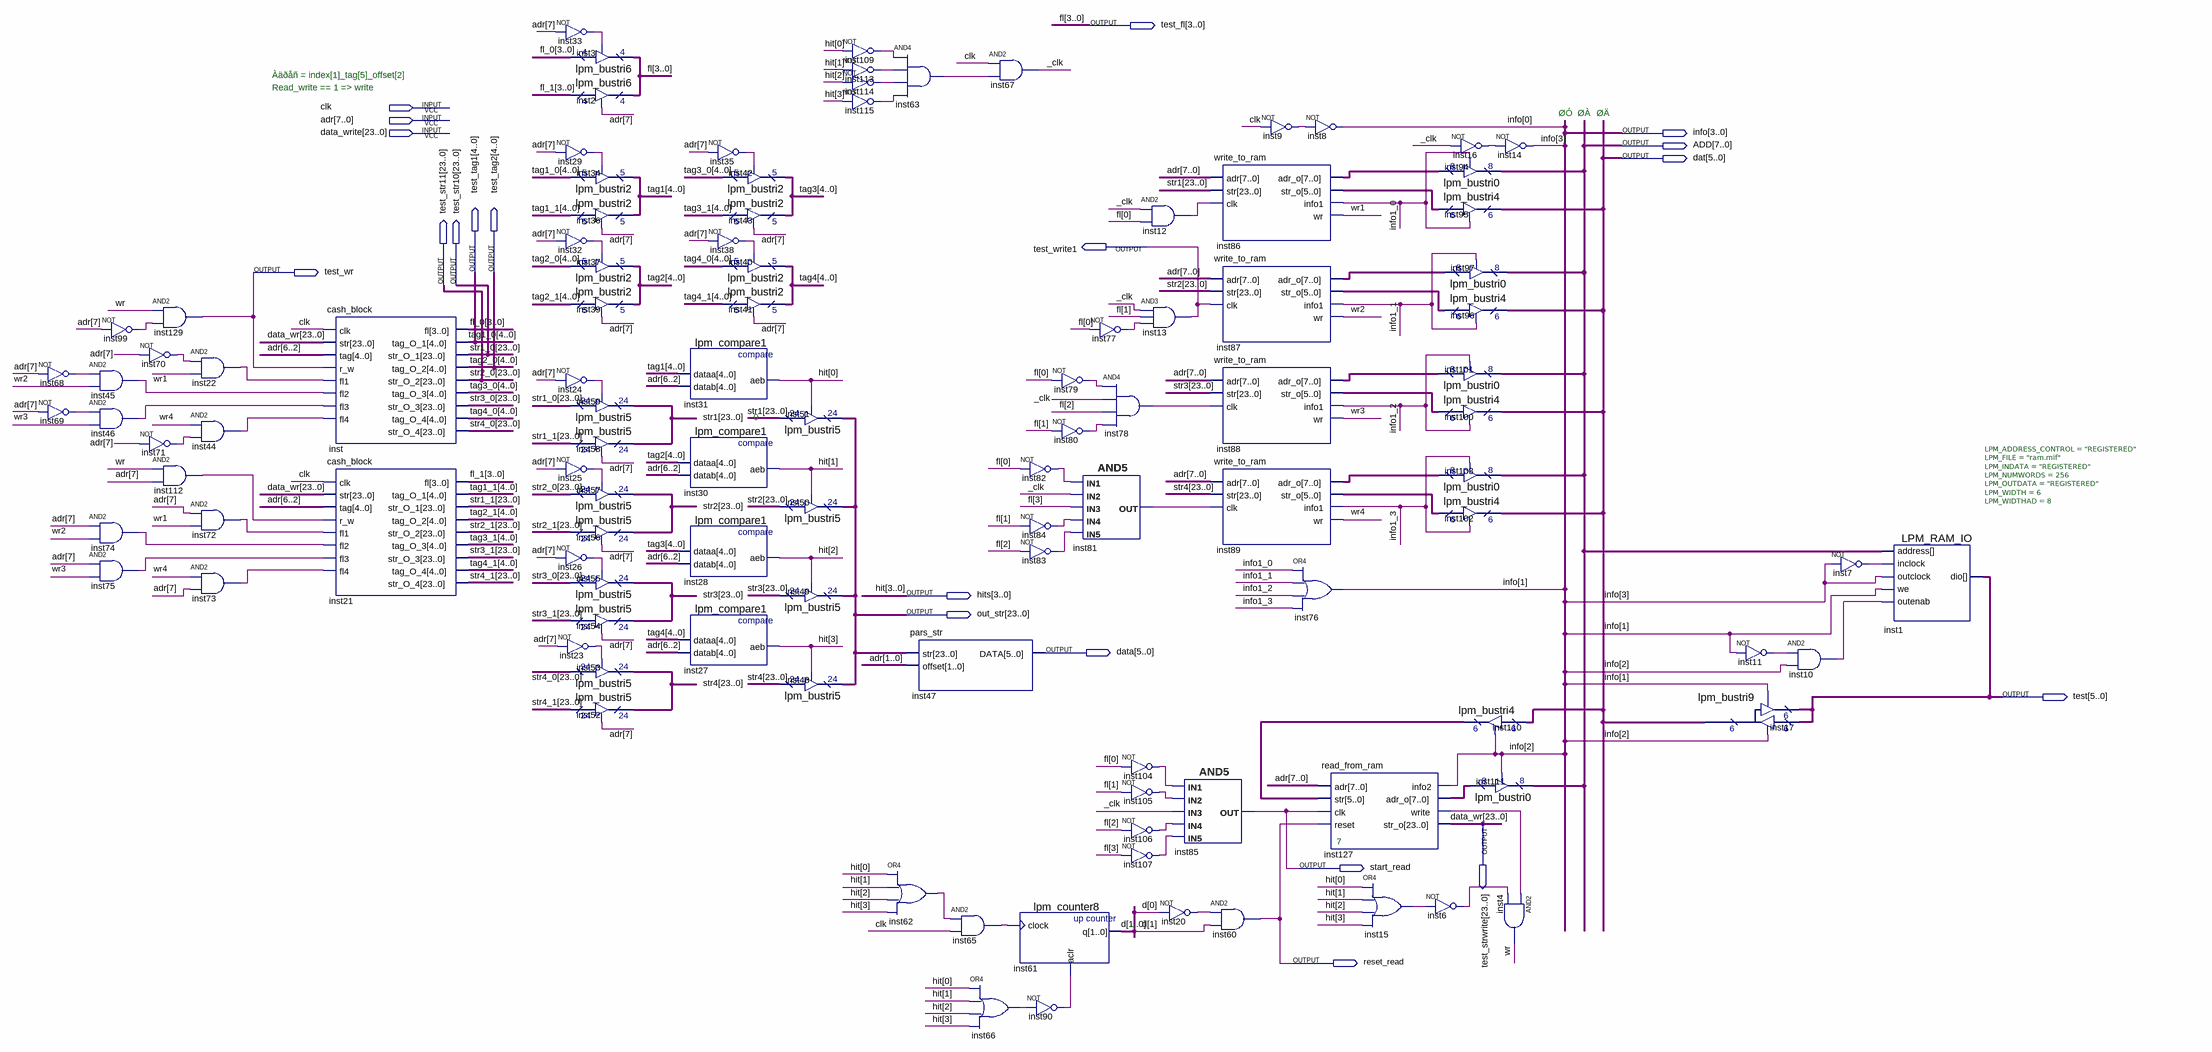
[diagram p0: schematic sheet]
// Quartus schematic lab6.bdf as structural Verilog: 109 symbols, 20 pins
module lab6 (
  input  clk,
  input  [7:0] adr,
  input  [23:0] data_write,
  output [3:0] test_fl,
  output [3:0] info,
  output [7:0] ADD,
  output [5:0] dat,
  output test_write1,
  output test_wr,
  output [4:0] test_tag1,
  output [4:0] test_tag2,
  output [23:0] test_str11,
  output [23:0] test_str10,
  output [3:0] hits,
  output [23:0] out_str,
  output [5:0] data,
  output [5:0] test,
  output [23:0] test_strwrite,
  output start_read,
  output reset_read
);

  wire _clk, info1_0, info1_1, info1_2, info1_3, inst6_out, inst7_out, inst9_out, inst10_out, inst11_out,
       inst12_out, inst15_out, inst16_out, inst20_out, inst22_out, inst23_out, inst24_out, inst25_out,
       inst26_out, inst29_out, inst32_out, inst33_out, inst35_out, inst38_out, inst44_out, inst45_out,
       inst46_out, inst62_out, inst63_out, inst65_out, inst66_out, inst68_out, inst69_out, inst70_out,
       inst71_out, inst72_out, inst73_out, inst74_out, inst75_out, inst77_out, inst78_out, inst79_out,
       inst80_out, inst81_out, inst82_out, inst83_out, inst84_out, inst90_out, inst99_out, inst104_out,
       inst105_out, inst106_out, inst107_out, inst109_out, inst112_out, inst113_out, inst114_out,
       inst115_out, inst127_write, wr, wr1, wr2, wr3, wr4;
  wire [1:0] d;
  wire [3:0] fl_0, fl_1;
  wire [4:0] tag1, tag1_1, tag2, tag2_1, tag3, tag3_0, tag3_1, tag4, tag4_0, tag4_1;
  wire [5:0] inst86_str_o, inst87_str_o, inst88_str_o, inst89_str_o, inst110_tridata;
  wire [7:0] inst86_adr_o, inst87_adr_o, inst88_adr_o, inst89_adr_o, inst127_adr_o;
  wire [23:0] str1, str1_1, str2, str2_1, str3, str3_0, str3_1, str4, str4_0, str4_1;

  not inst68 (inst68_out, adr[7]);
  not inst69 (inst69_out, adr[7]);
  not inst99 (inst99_out, adr[7]);
  and inst45 (inst45_out, inst68_out, wr2);
  and inst46 (inst46_out, inst69_out, wr3);
  and inst74 (inst74_out, adr[7], wr2);
  and inst75 (inst75_out, adr[7], wr3);
  and inst129 (test_wr, wr, inst99_out);
  not inst70 (inst70_out, adr[7]);
  not inst71 (inst71_out, adr[7]);
  and inst112 (inst112_out, wr, adr[7]);
  and inst22 (inst22_out, inst70_out, wr1);
  and inst44 (inst44_out, wr4, inst71_out);
  and inst72 (inst72_out, adr[7], wr1);
  and inst73 (inst73_out, wr4, adr[7]);
  cash_block inst (
    .clk(clk), .str(test_strwrite), .tag(adr[6:2]), .r_w(test_wr), .fl1(inst22_out), .fl2(inst45_out),
    .fl3(inst46_out), .fl4(inst44_out), .fl(fl_0), .tag_O_1(test_tag1), .str_O_1(test_str10),
    .tag_O_2(test_tag2), .str_O_2(test_str11), .tag_O_3(tag3_0), .str_O_3(str3_0), .tag_O_4(tag4_0),
    .str_O_4(str4_0));
  cash_block inst21 (
    .clk(clk), .str(test_strwrite), .tag(adr[6:2]), .r_w(inst112_out), .fl1(inst72_out), .fl2(inst74_out),
    .fl3(inst75_out), .fl4(inst73_out), .fl(fl_1), .tag_O_1(tag1_1), .str_O_1(str1_1), .tag_O_2(tag2_1),
    .str_O_2(str2_1), .tag_O_3(tag3_1), .str_O_3(str3_1), .tag_O_4(tag4_1), .str_O_4(str4_1));
  not inst33 (inst33_out, adr[7]);
  lpm_bustri6 inst3 (.enabledt(inst33_out), .data(fl_0), .tridata(test_fl));
  lpm_bustri6 inst2 (.enabledt(adr[7]), .data(fl_1), .tridata(test_fl));
  not inst29 (inst29_out, adr[7]);
  lpm_bustri2 inst34 (.enabledt(inst29_out), .data(test_tag1), .tridata(tag1));
  lpm_bustri2 inst36 (.enabledt(adr[7]), .data(tag1_1), .tridata(tag1));
  not inst32 (inst32_out, adr[7]);
  lpm_bustri2 inst37 (.enabledt(inst32_out), .data(test_tag2), .tridata(tag2));
  lpm_bustri2 inst39 (.enabledt(adr[7]), .data(tag2_1), .tridata(tag2));
  not inst24 (inst24_out, adr[7]);
  lpm_bustri5 inst59 (.enabledt(inst24_out), .data(test_str10), .tridata(str1));
  lpm_bustri5 inst58 (.enabledt(adr[7]), .data(str1_1), .tridata(str1));
  not inst25 (inst25_out, adr[7]);
  lpm_bustri5 inst57 (.enabledt(inst25_out), .data(test_str11), .tridata(str2));
  lpm_bustri5 inst56 (.enabledt(adr[7]), .data(str2_1), .tridata(str2));
  not inst26 (inst26_out, adr[7]);
  lpm_bustri5 inst55 (.enabledt(inst26_out), .data(str3_0), .tridata(str3));
  lpm_bustri5 inst54 (.enabledt(adr[7]), .data(str3_1), .tridata(str3));
  not inst23 (inst23_out, adr[7]);
  lpm_bustri5 inst53 (.enabledt(inst23_out), .data(str4_0), .tridata(str4));
  lpm_bustri5 inst52 (.enabledt(adr[7]), .data(str4_1), .tridata(str4));
  lpm_compare1 inst31 (.dataa(tag1), .datab(adr[6:2]), .aeb(hits[0]));
  lpm_compare1 inst30 (.dataa(tag2), .datab(adr[6:2]), .aeb(hits[1]));
  lpm_compare1 inst28 (.dataa(tag3), .datab(adr[6:2]), .aeb(hits[2]));
  lpm_compare1 inst27 (.dataa(tag4), .datab(adr[6:2]), .aeb(hits[3]));
  not inst35 (inst35_out, adr[7]);
  lpm_bustri2 inst42 (.enabledt(inst35_out), .data(tag3_0), .tridata(tag3));
  lpm_bustri2 inst43 (.enabledt(adr[7]), .data(tag3_1), .tridata(tag3));
  not inst38 (inst38_out, adr[7]);
  lpm_bustri2 inst40 (.enabledt(inst38_out), .data(tag4_0), .tridata(tag4));
  lpm_bustri2 inst41 (.enabledt(adr[7]), .data(tag4_1), .tridata(tag4));
  lpm_bustri5 inst51 (.enabledt(hits[0]), .data(str1), .tridata(out_str));
  lpm_bustri5 inst50 (.enabledt(hits[1]), .data(str2), .tridata(out_str));
  lpm_bustri5 inst49 (.enabledt(hits[2]), .data(str3), .tridata(out_str));
  lpm_bustri5 inst48 (.enabledt(hits[3]), .data(str4), .tridata(out_str));
  not inst109 (inst109_out, hits[0]);
  not inst113 (inst113_out, hits[1]);
  not inst114 (inst114_out, hits[2]);
  not inst115 (inst115_out, hits[3]);
  or inst62 (inst62_out, hits[0], hits[1], hits[2], hits[3]);
  and inst63 (inst63_out, inst109_out, inst113_out, inst114_out, inst115_out);
  pars_str inst47 (.str(out_str), .offset(adr[1:0]), .DATA(data));
  and inst67 (_clk, clk, inst63_out);
  and inst65 (inst65_out, inst62_out, clk);
  or inst66 (inst66_out, hits[0], hits[1], hits[2], hits[3]);
  not inst82 (inst82_out, test_fl[0]);
  not inst84 (inst84_out, test_fl[1]);
  not inst83 (inst83_out, test_fl[2]);
  lpm_counter8 inst61 (.clock(inst65_out), .aclr(inst90_out), .q(d));
  not inst90 (inst90_out, inst66_out);
  not inst77 (inst77_out, test_fl[0]);
  not inst79 (inst79_out, test_fl[0]);
  not inst80 (inst80_out, test_fl[1]);
  and inst81 (inst81_out, inst82_out, _clk, test_fl[3], inst84_out, inst83_out);
  and inst12 (inst12_out, _clk, test_fl[0]);
  and inst13 (test_write1, _clk, test_fl[1], inst77_out);
  and inst78 (inst78_out, inst79_out, _clk, test_fl[2], inst80_out);
  not inst104 (inst104_out, test_fl[0]);
  not inst105 (inst105_out, test_fl[1]);
  not inst106 (inst106_out, test_fl[2]);
  not inst107 (inst107_out, test_fl[3]);
  and inst85 (start_read, inst104_out, inst105_out, _clk, inst106_out, inst107_out);
  not inst20 (inst20_out, d[0]);
  write_to_ram inst86 (
    .adr(adr), .str(str1), .clk(inst12_out), .adr_o(inst86_adr_o), .str_o(inst86_str_o), .info1(info1_0),
    .wr(wr1));
  write_to_ram inst87 (
    .adr(adr), .str(str2), .clk(test_write1), .adr_o(inst87_adr_o), .str_o(inst87_str_o), .info1(info1_1),
    .wr(wr2));
  write_to_ram inst88 (
    .adr(adr), .str(str3), .clk(inst78_out), .adr_o(inst88_adr_o), .str_o(inst88_str_o), .info1(info1_2),
    .wr(wr3));
  write_to_ram inst89 (
    .adr(adr), .str(str4), .clk(inst81_out), .adr_o(inst89_adr_o), .str_o(inst89_str_o), .info1(info1_3),
    .wr(wr4));
  and inst60 (reset_read, inst20_out, d[1]);
  not inst9 (inst9_out, clk);
  or inst76 (info[1], info1_0, info1_1, info1_2, info1_3);
  not inst8 (info[0], inst9_out);
  read_from_ram inst127 (
    .adr(adr), .str(inst110_tridata), .clk(start_read), .reset(reset_read), .info2(info[2]),
    .adr_o(inst127_adr_o), .write(inst127_write), .str_o(test_strwrite));
  or inst15 (inst15_out, hits[0], hits[1], hits[2], hits[3]);
  lpm_bustri0 inst94 (.enabledt(info1_0), .data(inst86_adr_o), .tridata(ADD));
  lpm_bustri4 inst95 (.enabledt(info1_0), .data(inst86_str_o), .tridata(dat));
  lpm_bustri0 inst97 (.enabledt(info1_1), .data(inst87_adr_o), .tridata(ADD));
  lpm_bustri4 inst96 (.enabledt(info1_1), .data(inst87_str_o), .tridata(dat));
  lpm_bustri0 inst101 (.enabledt(info1_2), .data(inst88_adr_o), .tridata(ADD));
  lpm_bustri4 inst100 (.enabledt(info1_2), .data(inst88_str_o), .tridata(dat));
  lpm_bustri0 inst103 (.enabledt(info1_3), .data(inst89_adr_o), .tridata(ADD));
  lpm_bustri4 inst102 (.enabledt(info1_3), .data(inst89_str_o), .tridata(dat));
  not inst6 (inst6_out, inst15_out);
  not inst14 (info[3], inst16_out);
  not inst16 (inst16_out, _clk);
  lpm_bustri4 inst110 (.enabledt(info[2]), .data(dat), .tridata(inst110_tridata));
  lpm_bustri0 inst111 (.enabledt(info[2]), .data(inst127_adr_o), .tridata(ADD));
  and inst4 (wr, inst127_write, inst6_out);
  not inst11 (inst11_out, info[1]);
  lpm_bustri9 inst17 (.enabledt(info[2]), .data(test), .enabletr(info[1]), .result(test), .tridata(dat));
  and inst10 (inst10_out, inst11_out, info[2]);
  not inst7 (inst7_out, info[3]);
  LPM_RAM_IO #(.LPM_ADDRESS_CONTROL("REGISTERED"), .LPM_FILE("ram.mif"), .LPM_INDATA("REGISTERED"), .LPM_NUMWORDS(256), .LPM_OUTDATA("REGISTERED"), .LPM_WIDTH(6), .LPM_WIDTHAD(8)) inst1 (
    .address(ADD), .outclock(info[3]), .inclock(inst7_out), .we(info[1]), .outenab(inst10_out), .dio(test));

  // Other names for the same wires on the sheet: data_wr[23:0] = test_strwrite; fl[3:0] = test_fl; hit[3:0] = hits;
  //   tag2_0[4:0] = test_tag2; str1_0[23:0] = test_str10; str2_0[23:0] = test_str11; tag1_0[4:0] = test_tag1

  // Notes on the sheet:
  //   Àäðåñ = index[1]_tag[5]_offset[2]
  //   Read_write == 1 => write
  //   ØÓ
  //   ØÀ
  //   ØÄ
  //   0
  //   7
endmodule
